# Altium schematic sheet MCUtop.SchDoc
size A4; DocumentNumber: 4; SheetNumber: 4; SheetTotal: 21; SheetName: Microcontroller Top Level
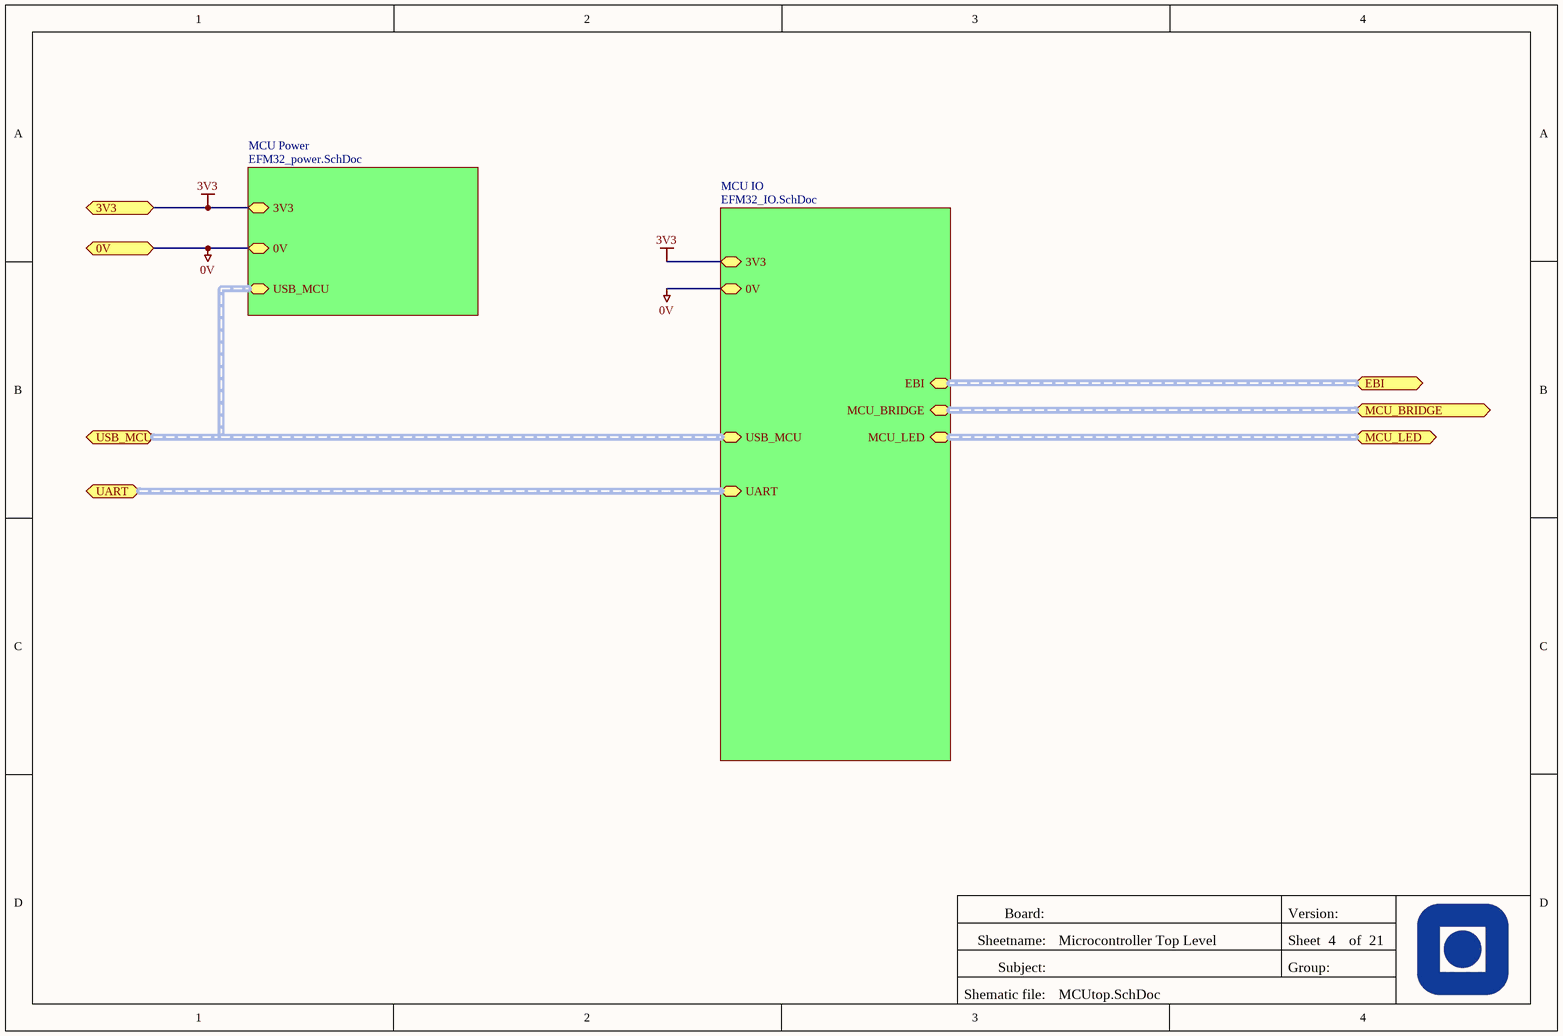
[diagram p0: MCUtop.SchDoc]

## Sub-sheets
MCU IO = EFM32_IO.SchDoc: MCU_BRIDGE (harness MCU_CTRL_LOGIC), USB_MCU (harness USB), EBI (harness EBI), MCU_LED (harness LED_Harness), 3V3, 0V, UART (harness UART)
MCU Power = EFM32_power.SchDoc: 3V3, 0V, USB_MCU (harness USB)

## Ports
0V, 3V3, EBI (harness EBI), MCU_BRIDGE (harness MCU_CTRL_LOGIC), MCU_LED (harness LED_Harness), UART (harness UART), USB_MCU (harness USB)

## Nets
0V: port 0V, sheet MCU Power/0V, sheet MCU IO/0V
3V3: port 3V3, sheet MCU Power/3V3, sheet MCU IO/3V3

## Buses and harness runs
harness port EBI = sheet MCU IO/EBI
harness port MCU_BRIDGE = sheet MCU IO/MCU_BRIDGE
harness port MCU_LED = sheet MCU IO/MCU_LED
harness port UART = sheet MCU IO/UART
harness port USB_MCU = sheet MCU IO/USB_MCU = sheet MCU Power/USB_MCU

## Notes on the sheet
- Board:
- Version:
- Sheetname:
- Subject:
- Group:
- Sheet
- of
- Shematic file: